# EAGLE design TwistIt (EAGLE 7.7.0)
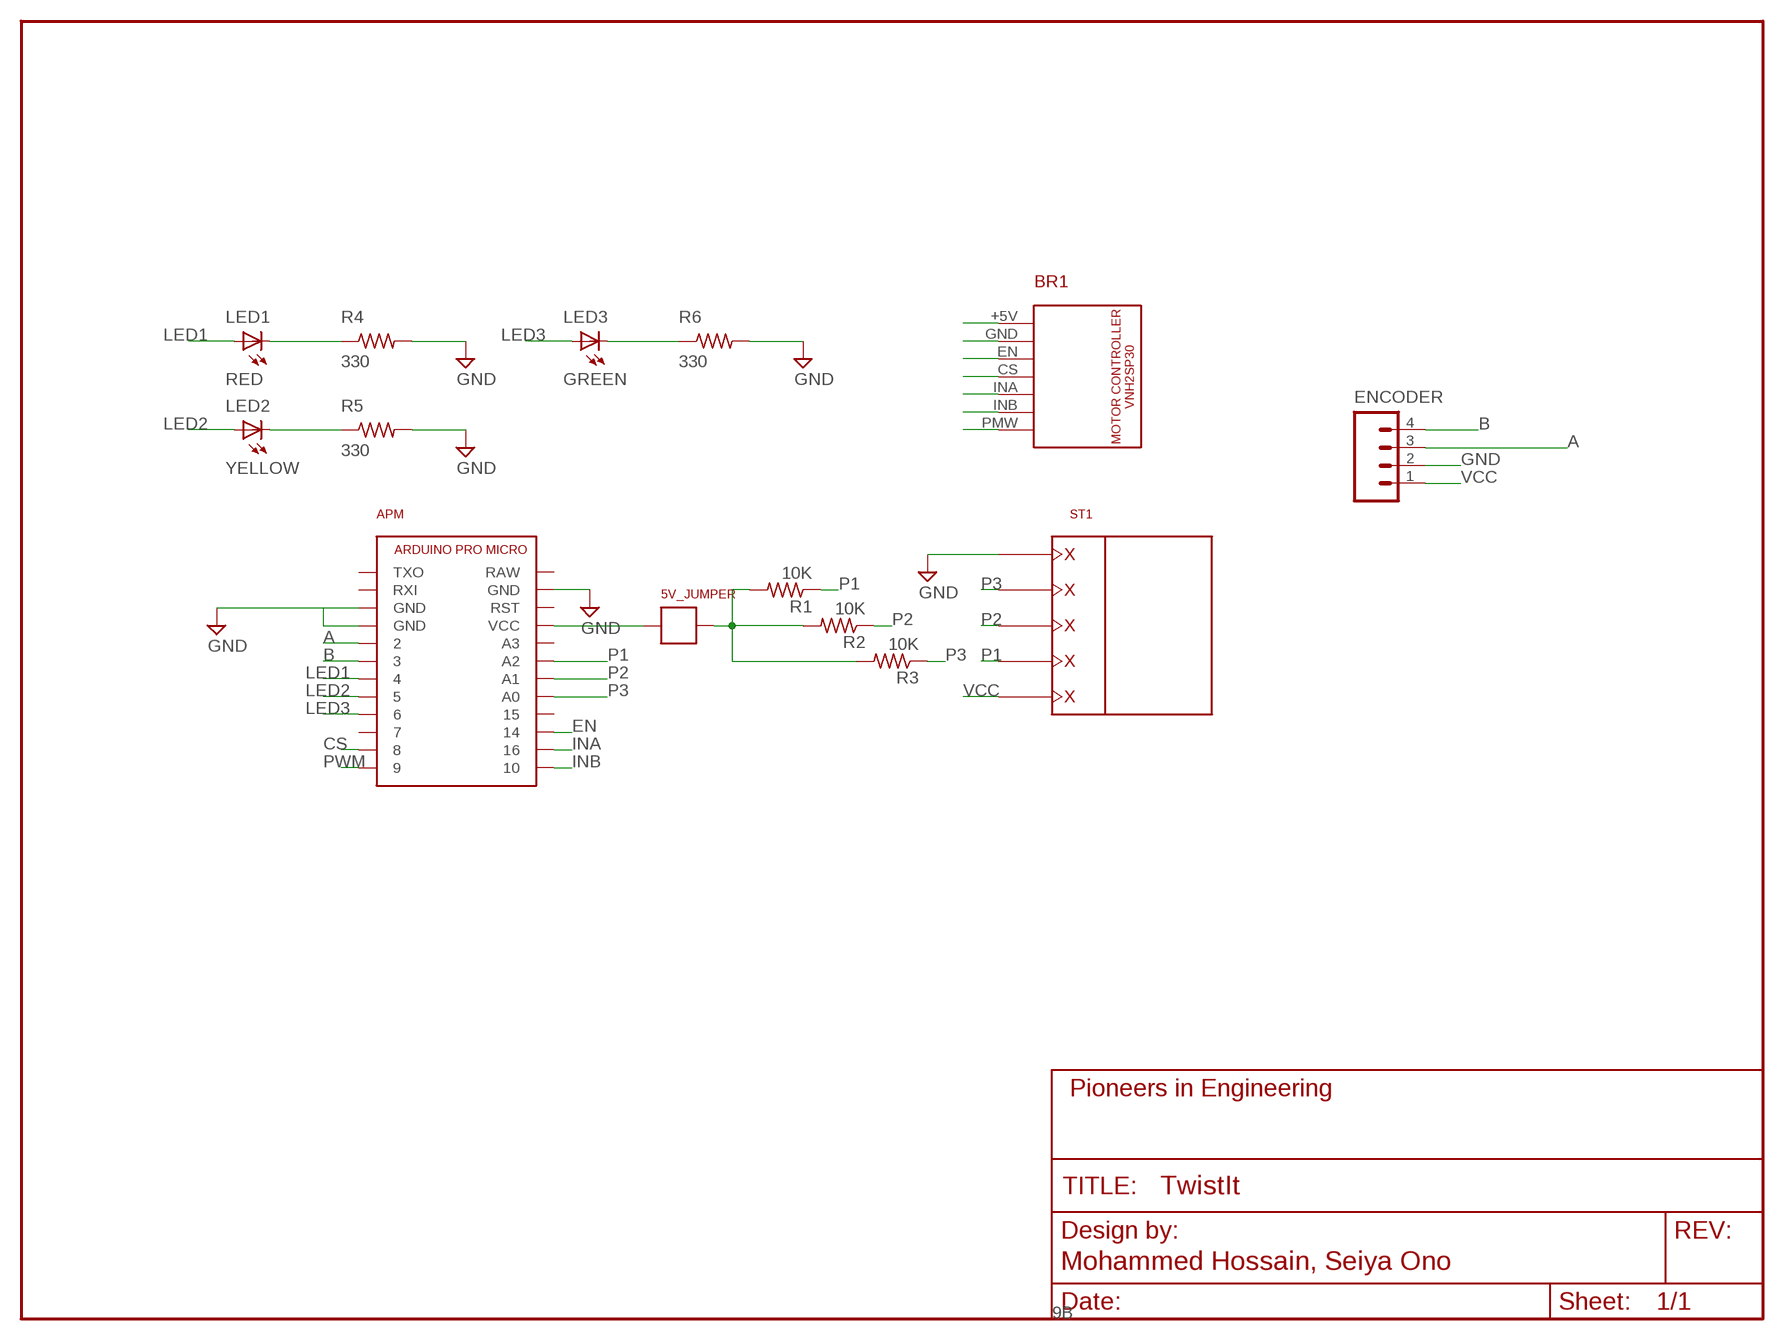
[diagram p0: schematic, sheet 1]
FRAME1 (FRAME_SCHEMATIC): AUTHOR: Mohammed Hossain, Seiya Ono; REVISION: 9B

## Parts
5V_JUMPER  JUMPER  [JUMPER]
APM  ARDUINO_PRO_MICRO  [ARDUINO_PRO_MICRO]
BR1  VNH2SP30_MOTOR_CONTROLLER  [VNH2SP30_MOTOR_CONTROLLER]
ENCODER  M041X04-MTA  [1X04-MTA]
LED1  RED  LED-FKIT-1206  [FKIT-LED-1206]
LED2  YELLOW  LED-FKIT-1206  [FKIT-LED-1206]
LED3  GREEN  LED-FKIT-1206  [FKIT-LED-1206]
R1  10K  R-US_R0603  [R0603]
R2  10K  R-US_R0603  [R0603]
R3  10K  R-US_R0603  [R0603]
R4  330  R-US_R0603  [R0603]
R5  330  R-US_R0603  [R0603]
R6  330  R-US_R0603  [R0603]
ST1  5PIN_SCREW  [5PIN_SCREW]

## Nets
5V: 5V_JUMPER.P$2 R1.2 R2.2 R3.2
A: APM.2 ENCODER.3
B: APM.3 ENCODER.4
CS: APM.8 BR1.CS
EN: APM.14 BR1.EN
GND: APM.GND@0(GND) APM.GND@1(GND) APM.GND@2(GND) BR1.GND ENCODER.2 R4.2 R5.2 R6.2 ST1.P$1
INA: APM.16 BR1.INA
INB: APM.10 BR1.INB
LED1: APM.4 LED1.A
LED2: APM.5 LED2.A
LED3: APM.6 LED3.A
N$2: LED1.C R4.1
N$4: LED2.C R5.1
N$6: LED3.C R6.1
P1: APM.A2 R1.1 ST1.P$4
P2: APM.A1 R2.1 ST1.P$3
P3: APM.A0 R3.1 ST1.P$2
PWM: APM.9 BR1.PMW
VCC: 5V_JUMPER.P$1 APM.VCC BR1.+5V ENCODER.1 ST1.P$5
Unconnected: APM.7 APM.15 APM.A3 APM.RAW APM.RST APM.RXI APM.TXO

## Library data of the parts
5V_JUMPER = pie:JUMPER: 2 Pin Jumper; DESCRIPTION: JUMPER; DISTRIBUTOR: DigiKey; DISTRIBUTOR_PART_NUMBER: 952-2262-ND; MANUFACTURER: Harwin. Inc; MANUFACTURER_PART_NUMBER: M20-9990246; PACKAGE: JP
APM = pie:ARDUINO_PRO_MICRO: Arduino Pro Micro Electrical System Year 9's Smart Sensor Core Pin Outs <https://cdn.sparkfun.com/assets/9/c/3/c/4/523a1765757b7f5c6e8b4567.png> Buy Here <http://www.aliexpress.com/item/Mini-Leonardo-Pro-Micro-ATmega32U4-5V-16MHz-Module-For-Arduino-Best-Quality/32284746884.html?ws_ab_test=searchweb201556_8,searchweb201602_2_10057_10056_10065_10055_10054_10067_10069_10059_10058_10017_10070_10060_10061_10052_10062_10053_10050_10051,searchweb201603_1&btsid=45993952-29ca-4de4-a0fb-c7fb72b8e1a5> Thru Hole Female Pins <http://www.digikey.com/product-search/en?keywords=929974E-01-12-ND> Surface Mount Female Pins <http://www.digikey.com/product-detail/en/sullins-connector-solutions/NPTC121KFXC-RC/S5604-ND/776062>; DESCRIPTION: Arduino Pro Micro; DISTRIBUTOR: AliExpress; DISTRIBUTOR_PART_NUMBER: 32284746884; MANUFACTURER: Feiyang electronics; NOTES: https://www.aliexpress.com/item/Mini-Leonardo-Pro-Micro-ATmega32U4-5V-16MHz-Module-For-Arduino-Best-Quality/32284746884.html?ws_ab_test=searchweb201556_8,searchweb201602_2_10057_10056_10065_10055_10054_10067_10069_10059_10058_10017_10070_10060_10061_10052_10062_10053_10050_10051,searchweb201603_1&btsid=45993952-29ca-4de4-a0fb-c7fb72b8e1a5; PACKAGE: ARDUINO_PRO_MICRO; REFERENCE_DEST: ARDUINO_PRO_MICRO
BR1 = pie:VNH2SP30_MOTOR_CONTROLLER: VNH2SP30 MOTOR CONTROLLER
ENCODER = pie:M04: 4-pin 0.1-inch header and MTA connector; PIE-INT-REF-NUM: MTA
LED1-LED3 = pie:LED: LEDs Standard schematic elements and footprints for 5mm, 3mm, 1206, and 0603 sized LEDs. 5mm - Spark Fun Electronics SKU : COM-00529 (and others); PIE-INT-REF-NUM: LED
R1-R3 = resistor:R-US_: RESISTOR, American symbol
R4-R6 = pie:R-US_: RESISTOR, American symbol; DESCRIPTION: RESISTOR, American symbol; DISTRIBUTOR: DigiKey; MANUFACTURER: Rohm Semiconductor; NOTES: Cut Tape; PACKAGE: R0603; VALUE: >VALUE
ST1 = pie:5PIN_SCREW: 5 Pin Screw Terminal Sparkfun Page <https://www.sparkfun.com/products/8432> 5mm Pitch The 2 and 3 Pins Screw Terminals can be linked together seamlessly.; DESCRIPTION: 5 pin Screw Terminal; DISTRIBUTOR: DigiKey; DISTRIBUTOR_PART_NUMBER: 277-1239-ND; MANUFACTURER: Phoenix Contact; MANUFACTURER_PART_NUMBER: 1729047; PACKAGE: 5PIN_SCREW

## Board
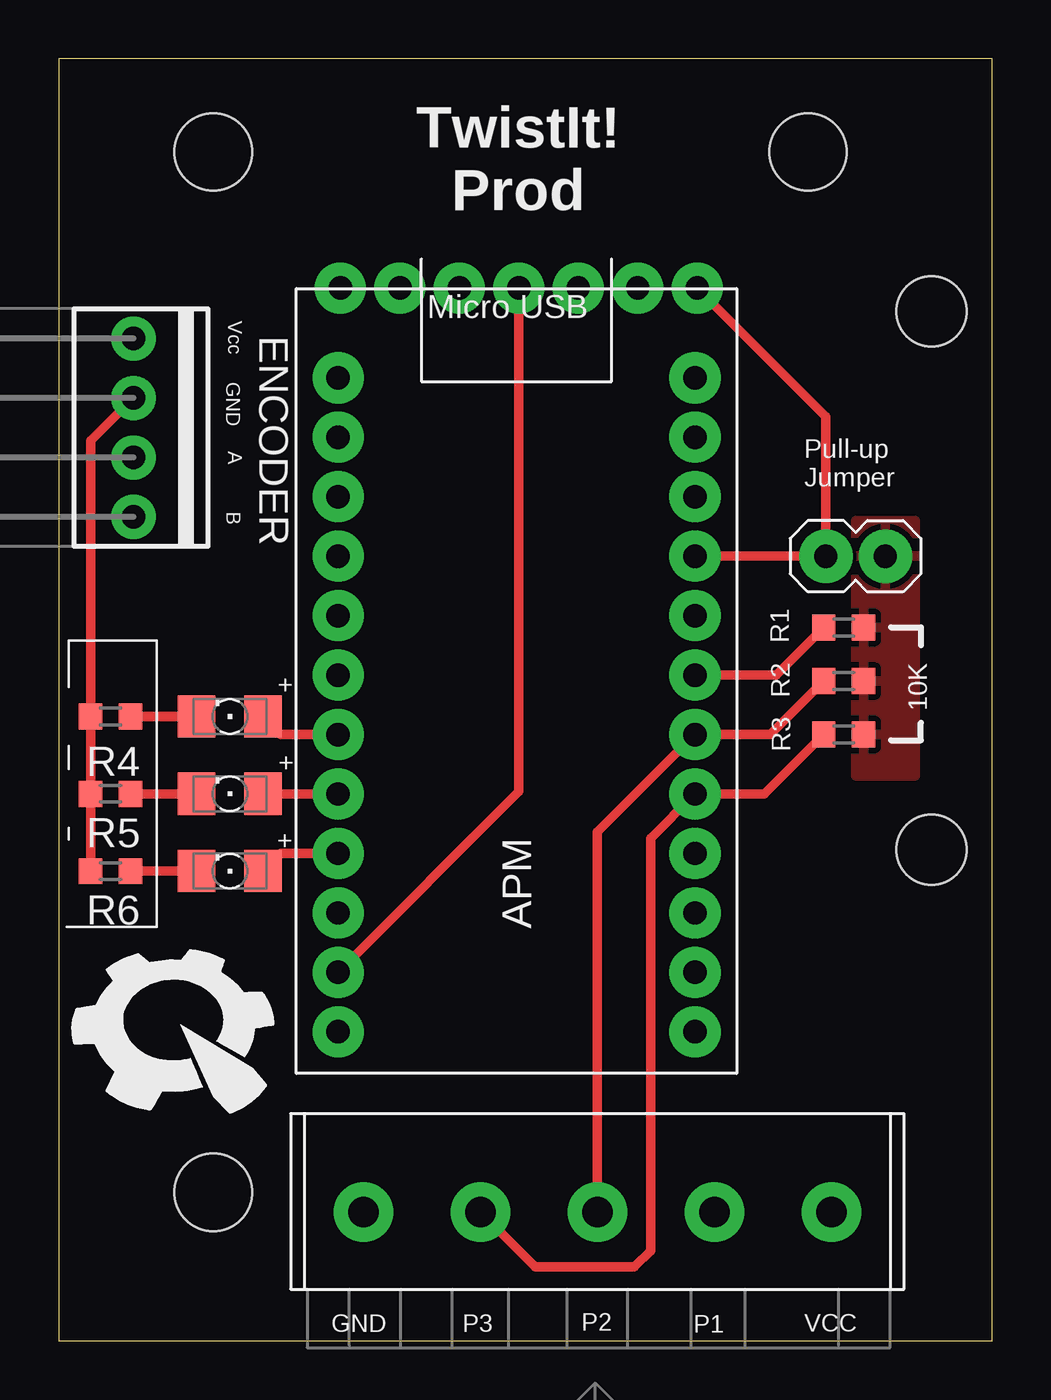
[diagram p1: board, top side]
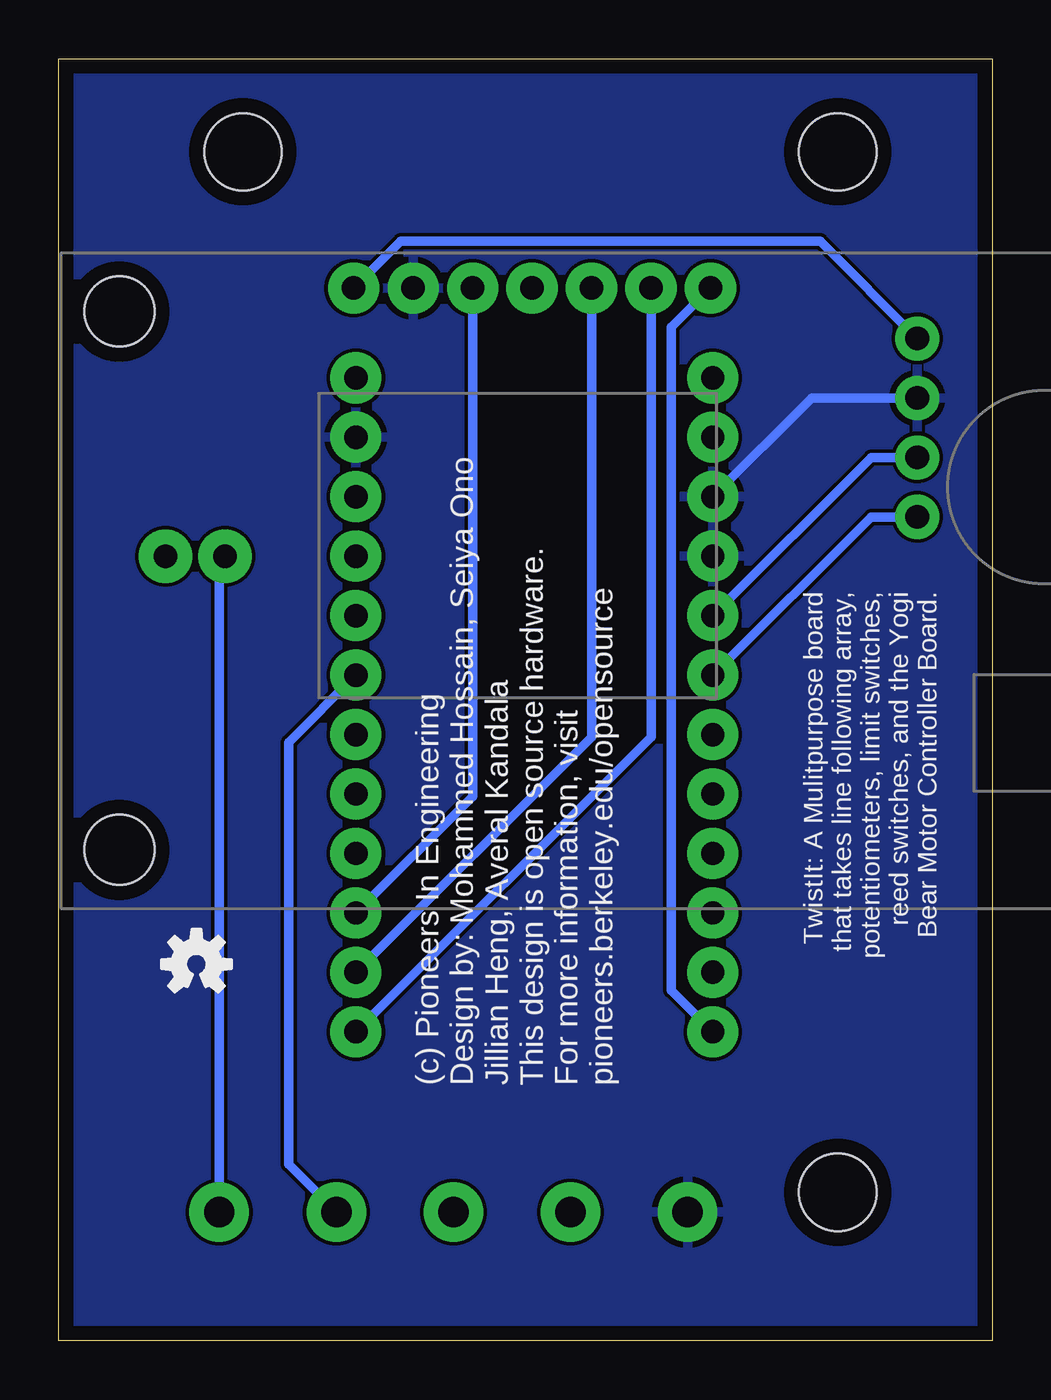
[diagram p2: board, bottom side, seen from below]

Size 39.88 x 54.79 mm. Coordinates in mm from the lower left corner, seen from the top.
Outline: 0,0 39.88,0 39.88,54.79 0,54.79 0,0
Copper layers (1*16): Top 2mil / dielectric 9mil / Bottom 2mil
Design rules "pie": minimum track width 6mil, minimum drill 15mil, track to track 6mil, track to pad 6mil, pad to pad 6mil, via to via 6mil, smd to smd 6mil, copper to edge 25mil, drill to drill 7mil, minimum pad ring 7mil, minimum via ring 7mil, stop-mask expansion 3mil, vias tented up to drill 21mil, thermal gap 10mil

### Footprints (pad centres in the part's own frame; a part is rotated, then mirrored left to right if it is on the bottom)
JUMPER = drill 1 pad 2.286: P$1 -1.27,0; P$2 1.27,0
ARDUINO_PRO_MICRO = drill 1 pad 2.184: 2 1.778,19.558; 3 1.778,17.018; 4 1.778,14.478; 5 1.778,11.938; 6 1.778,9.398; 7 1.778,6.858; 8 1.778,4.318; 9 1.778,1.778; 10 17.018,1.778; 14 17.018,6.858; 15 17.018,9.398; 16 17.018,4.318; A0 17.018,11.938; A1 17.018,14.478; A2 17.018,17.018; A3 17.018,19.558; GND@0 1.778,24.638; GND@1 1.778,22.098; GND@2 17.018,27.178; RAW 17.018,29.718; RST 17.018,24.638; RXI 1.778,27.178; TXO 1.778,29.718; VCC 17.018,22.098
VNH2SP30_MOTOR_CONTROLLER = drill 1 pad 2.184: +5V 41.5,1.5; CS 33.88,1.5; EN 36.42,1.5; GND 38.96,1.5; INA 31.34,1.5; INB 28.8,1.5; PMW 26.26,1.5 | hole 3: 51.5,2.5; 51.5,25.5
1X04-MTA = drill 1.016 pad 1.88: 1 -3.81,0; 2 -1.27,0; 3 1.27,0; 4 3.81,0
FKIT-LED-1206 = smd 1.6 x 1.803: A -1.422,0; C 1.422,0
R0603 = smd 1 x 1.1: 1 -0.85,0; 2 0.85,0
5PIN_SCREW = drill 1.3 pad 2.54: P$1 3.1,3.3; P$2 8.1,3.3; P$3 13.1,3.3; P$4 18.1,3.3; P$5 23.1,3.3
STAND-OFF = hole 3.302: 0,0

### Placement (x,y rotation side)
5V_JUMPER  34.04,33.53 0 top
APM  10.16,11.43 0 top
BR1  -14.22,46.48 180 bottom
ENCODER  3.2,39.02 270 top
LED1  7.32,26.68 180 top
LED2  7.32,23.38 180 top
LED3  7.32,20.07 180 top
R1  33.53,30.48 0 top
R2  33.53,28.19 0 top
R3  33.53,25.91 0 top
R4  2.22,26.68 180 top
R5  2.22,23.37 180 top
R6  2.22,20.07 180 top
ST1  9.92,2.21 0 top
U$1  [STAND-OFF]  32,50.8 0 top
U$3  [PIE-LOGO-SMALL]  5.2,13.54 0 top
U$4  [OSHW-LOGO-S]  33.99,16.09 0 bottom
U$5  [STAND-OFF]  6.6,50.8 0 top
U$6  [STAND-OFF]  6.6,6.35 0 top

### Tracks (layer width: path | path; a pad name or v marks a point on that pad's centre or on a via)
5V
  pour Top: 34.04,35.05 36.58,35.05 36.58,24.13 34.04,24.13
A
  Bottom 0.406: ENCODER.3 5.18,37.75 APM.2
B
  Bottom 0.406: ENCODER.4 5.18,35.21 APM.3
CS
  Top 0.406: BR1.CS 19.66,23.47 APM.8
EN
  Bottom 0.406: BR1.EN 22.2,23.27 APM.14
GND
  Top 0.406: R6.2 R5.2 R4.2 1.37,38.46 ENCODER.2
  Bottom 0.406: ENCODER.2 7.72,40.29 APM.GND@0
  pour Bottom: 0,54.61 39.88,54.61 39.88,0 0,0
INA
  Bottom 0.406: BR1.INA 17.12,25.81 APM.16
INB
  Bottom 0.406: BR1.INB 14.58,25.81 APM.10
LED1
  Top 0.406: LED1.A 9.5,25.92 APM.4
LED2
  Top 0.406: LED2.A APM.5
LED3
  Top 0.406: 9.5,20.84 LED3.A 9.49,20.83 APM.6
N$2
  Top 0.406: R4.1 LED1.C
N$4
  Top 0.406: R5.1 LED2.C
N$6
  Top 0.406: R6.1 LED3.C
P1
  Top 0.406: APM.A2 30.65,28.45 R1.1
  Bottom 0.406: ST1.P$4 30.05,7.55 30.05,25.57 APM.A2
P2
  Top 0.406: R2.1 30.39,25.91 APM.A1 23.02,21.75 ST1.P$3
P3
  Top 0.406: R3.1 30.14,23.37 APM.A0 25.28,21.47 25.28,3.85 24.59,3.16 20.37,3.16 ST1.P$2
PWM
  Bottom 0.406: BR1.PMW 13.72,43.3 13.72,14.99 APM.9
VCC
  Top 0.406: APM.VCC 5V_JUMPER.P$1 32.77,39.49 BR1.+5V
  Bottom 0.406: ENCODER.1 7.36,46.99 25.27,46.99 BR1.+5V | ST1.P$5 33.02,33.28 5V_JUMPER.P$1

### Text on the board
tPlace: TwistIt! / Prod
tNames: Vcc | GND | A | Pull-up / Jumper | B | + | 10K | + | + | GND | P3 | P2 | P1 | VCC
bNames: TwistIt: A Mulitpurpose board / that takes line following array, / potentiometers, limit switches, / reed switches, and the Yogi / Bear Motor Controller Board. | (c) Pioneers In Engineering / Design by: Mohammed Hossain, Seiya Ono / Jillian Heng, Averal Kandala / This design is open source hardware. / For more information, visit / pioneers.berkeley.edu/opensource